# Altium project DRLVoltage.PrjPCB
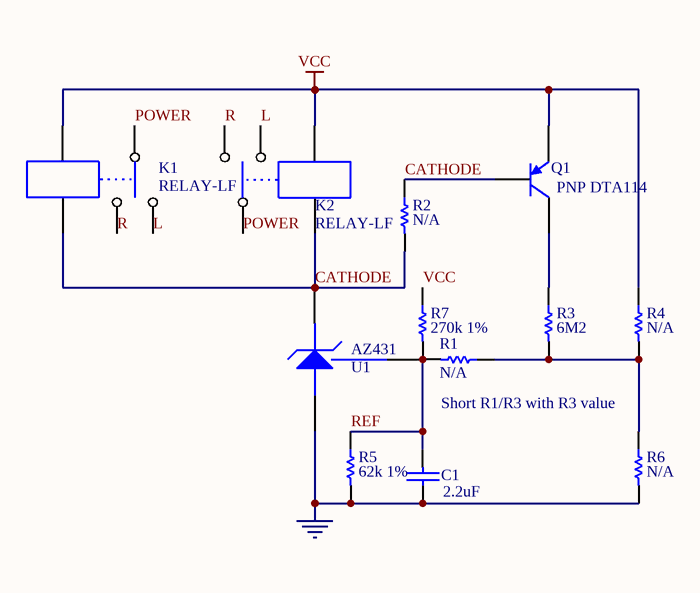
[diagram p0: DRLVoltage.SchDoc]
1 sheet, 12 parts. Net scope: global (net labels, ports and power ports of the same name join across sheets).
Board file: DRLVoltage.PcbDoc

## Sheet DRLVoltage.SchDoc
size A4

### Parts
C1  2.2uF  [0603]
K1  RELAY-LF  [RELAY5PIN]
K2  RELAY-LF  [RELAY5PIN]
Q1  PNP DTA114  [sot-23]
R1  N/A  [0603]
R2  N/A  [0603]
R3  6M2  [0603]
R4  N/A  [0603]
R5  62k 1%  [0603]
R6  N/A  [0603]
R7  270k 1%  [0603]
U1  AZ431  [SOT-23]

### Nets
PGND: C1.2 R5.2 R6.2 U1.2(A)
VCC: K1.4 K2.5 Q1.3(E) R4.1 R7.1
CATHODE: K1.5 K2.4 Q1.1(B) R2.1 R2.2 U1.3(K)
L: K1.2 K2.3
POWER: K1.1 K2.1
R: K1.3 K2.2
REF: C1.1 R1.2 R5.1 R7.2 U1.1(REF)
NetQ1_2: Q1.2(C) R3.1
NetR1_1: R1.1 R3.2 R4.2 R6.1

### Notes on the sheet
- Short R1/R3 with R3 value

### Library data of the parts
C1 = CAP: Capacitor
K1 K2 = RELAY-SPDT
Q1 = PNP: PNP Bipolar Transistor; Manufacturer: Generic Components; Class: Discrete; SubClass: BJT - Low Power; Published: 08/06/2000; Publisher: Altium Hobart Technology Centre
R1-R7 = Res1: Resistor; Manufacturer: Generic Components; Class: Passive; Value: 4k7; Published: 08/06/2000; Publisher: Altium Hobart Technology Centre; SubClass: Resistor
U1 = TL431